# EAGLE design untitled2 (EAGLE 9.6.2)
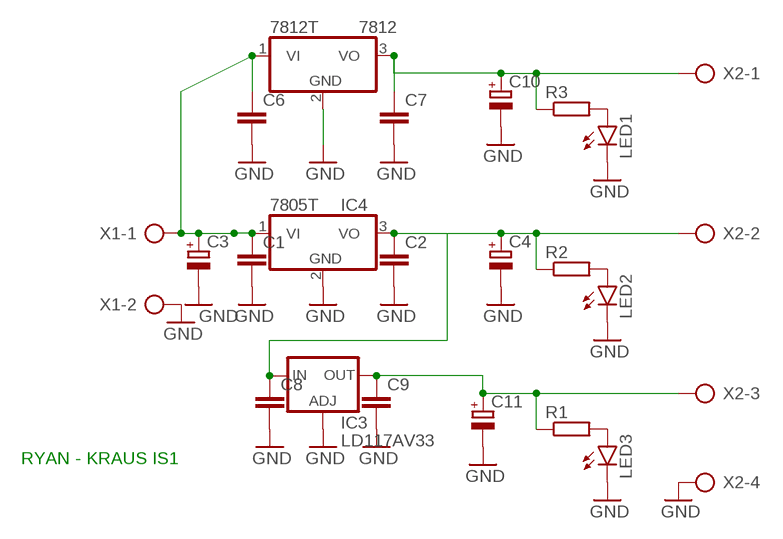
[diagram p0: schematic, sheet 1]

## Parts
7812  7812T  [TO220H]
C1  C-EU050-025X075  [C050-025X075]
C2  C-EU050-025X075  [C050-025X075]
C3  CPOL-EUE5-13  [E5-13]
C4  CPOL-EUE5-6  [E5-6]
C6  C-EU050-025X075  [C050-025X075]
C7  C-EU050-025X075  [C050-025X075]
C8  C-EU050-025X075  [C050-025X075]
C9  C-EU050-025X075  [C050-025X075]
C10  CPOL-EUE5-6  [E5-6]
C11  CPOL-EUE5-6  [E5-6]
IC3  LD117AV33  [TO220L1]
IC4  7805T  [TO220H]
LED1  LED5MM  [LED5MM]
LED2  LED5MM  [LED5MM]
LED3  LED5MM  [LED5MM]
R1  R-EU_0204/7  [0204/7]
R2  R-EU_0204/7  [0204/7]
R3  R-EU_0204/7  [0204/7]
X1  AK300/2  [AK300/2]
X2  AK300/4  [AK300/4]

## Nets
GND: 7812.2(GND) C1.2 C2.2 C3.- C4.- C6.2 C7.2 C8.2 C9.2 C10.- C11.- IC3.1(ADJ) IC4.2(GND) LED1.K(C) LED2.K(C) LED3.K(C) X1.2 X2.4
N$1: 7812.1(VI) C1.1 C3.+ C6.1 IC4.1(VI) X1.1
N$5: C2.1 C4.+ C8.1 IC3.3(IN) IC4.3(VO) R2.1 X2.2
N$7: C9.1 C11.+ IC3.2(OUT) R1.1 X2.3
N$8: 7812.3(VO) C7.1 C10.+ R3.1 X2.1
N$9: LED3.A R1.2
N$10: LED2.A R2.2
N$11: LED1.A R3.2

## Notes on the sheet
- RYAN - KRAUS IS1

## Library data of the parts
7812 IC4 = linear:78*: Positive VOLTAGE REGULATOR Source: http://cache.national.com/ds/LM/LM78L05.pdf http://www.fairchildsemi.com/ds/LM/LM7805.pdf
C1 C2 C6-C9 = rcl:C-EU: CAPACITOR, European symbol; SPICEPREFIX: C
C3 C4 C10 C11 = rcl:CPOL-EU: POLARIZED CAPACITOR, European symbol; SPICEPREFIX: C
IC3 = v-reg:LD117A?*: Low drop fixed and adjustable positive voltage regulators 1 A Source: http://www.st.com/stonline/products/literature/ds/7194/ld1117axx.pdf
LED1-LED3 = led:LED: LED OSRAM: - CHIPLED LG R971, LG N971, LY N971, LG Q971, LY Q971, LO R971, LY R971 LH N974, LH R974 LS Q976, LO Q976, LY Q976 LO Q996 - Hyper CHIPLED LW Q18S LB Q993, LB Q99A, LB R99A - SideLED LS A670, LO A670, LY A670, LG A670, LP A670 LB A673, LV A673, LT A673, LW A673 LH A674 LY A675 LS A676, LA A676, LO A676, LY A676, LW A676 LS A679, LY A679, LG A679 - Hyper Micro SIDELED® LS Y876, LA Y876, LO Y876, LY Y876 LT Y87S - SmartLED LW L88C, LW L88S LB L89C, LB L89S, LG L890 LS L89K, LO L89K, LY L89K LS L896, LA L896, LO L896, LY L896 - TOPLED LS T670, LO T670, LY T670, LG T670, LP T670 LSG T670, LSP T670, LSY T670, LOP T670, LYG T670 LG T671, LOG T671, LSG T671 LB T673, LV T673, LT T673, LW T673 LH T674 LS T676, LA T676, LO T676, LY T676, LB T676, LH T676, LSB T676, LW T676 LB T67C, LV T67C, LT T67C, LS T67K, LO T67K, LY T67K, LW E67C LS E67B, LA E67B, LO E67B, LY E67B, LB E67C, LV E67C, LT E67C LW T67C LS T679, LY T679, LG T679 LS T770, LO T770, LY T770, LG T770, LP T770 LB T773, LV T773, LT T773, LW T773 LH T774 LS E675, LA E675, LY E675, LS T675 LS T776, LA T776, LO T776, LY T776, LB T776 LHGB T686 LT T68C, LB T68C - Hyper Mini TOPLED® LB M676 - Mini TOPLED Santana® LG M470 LS M47K, LO M47K, LY M47K Source: http://www.osram.convergy.de LUXEON: - LUMILED® LXK2-PW12-R00, LXK2-PW12-S00, LXK2-PW14-U00, LXK2-PW14-V00 LXK2-PM12-R00, LXK2-PM12-S00, LXK2-PM14-U00 LXK2-PE12-Q00, LXK2-PE12-R00, LXK2-PE12-S00, LXK2-PE14-T00, LXK2-PE14-U00 LXK2-PB12-K00, LXK2-PB12-L00, LXK2-PB12-M00, LXK2-PB14-N00, LXK2-PB14-P00, LXK2-PB14-Q00 LXK2-PR12-L00, LXK2-PR12-M00, LXK2-PR14-Q00, LXK2-PR14-R00 LXK2-PD12-Q00, LXK2-PD12-R00, LXK2-PD12-S00 LXK2-PH12-R00, LXK2-PH12-S00 LXK2-PL12-P00, LXK2-PL12-Q00, LXK2-PL12-R00 Source: www.luxeon.com KINGBRIGHT: KA-3528ASYC Source: www.kingbright.com
R1-R3 = rcl:R-EU_: RESISTOR, European symbol; SPICEPREFIX: R
X1 = con-ptr500:AK300/2: CONNECTOR; OC_FARNELL: unknown; OC_NEWARK: unknown
X2 = con-ptr500:AK300/4: CONNECTOR; OC_FARNELL: unknown; OC_NEWARK: unknown

## Board
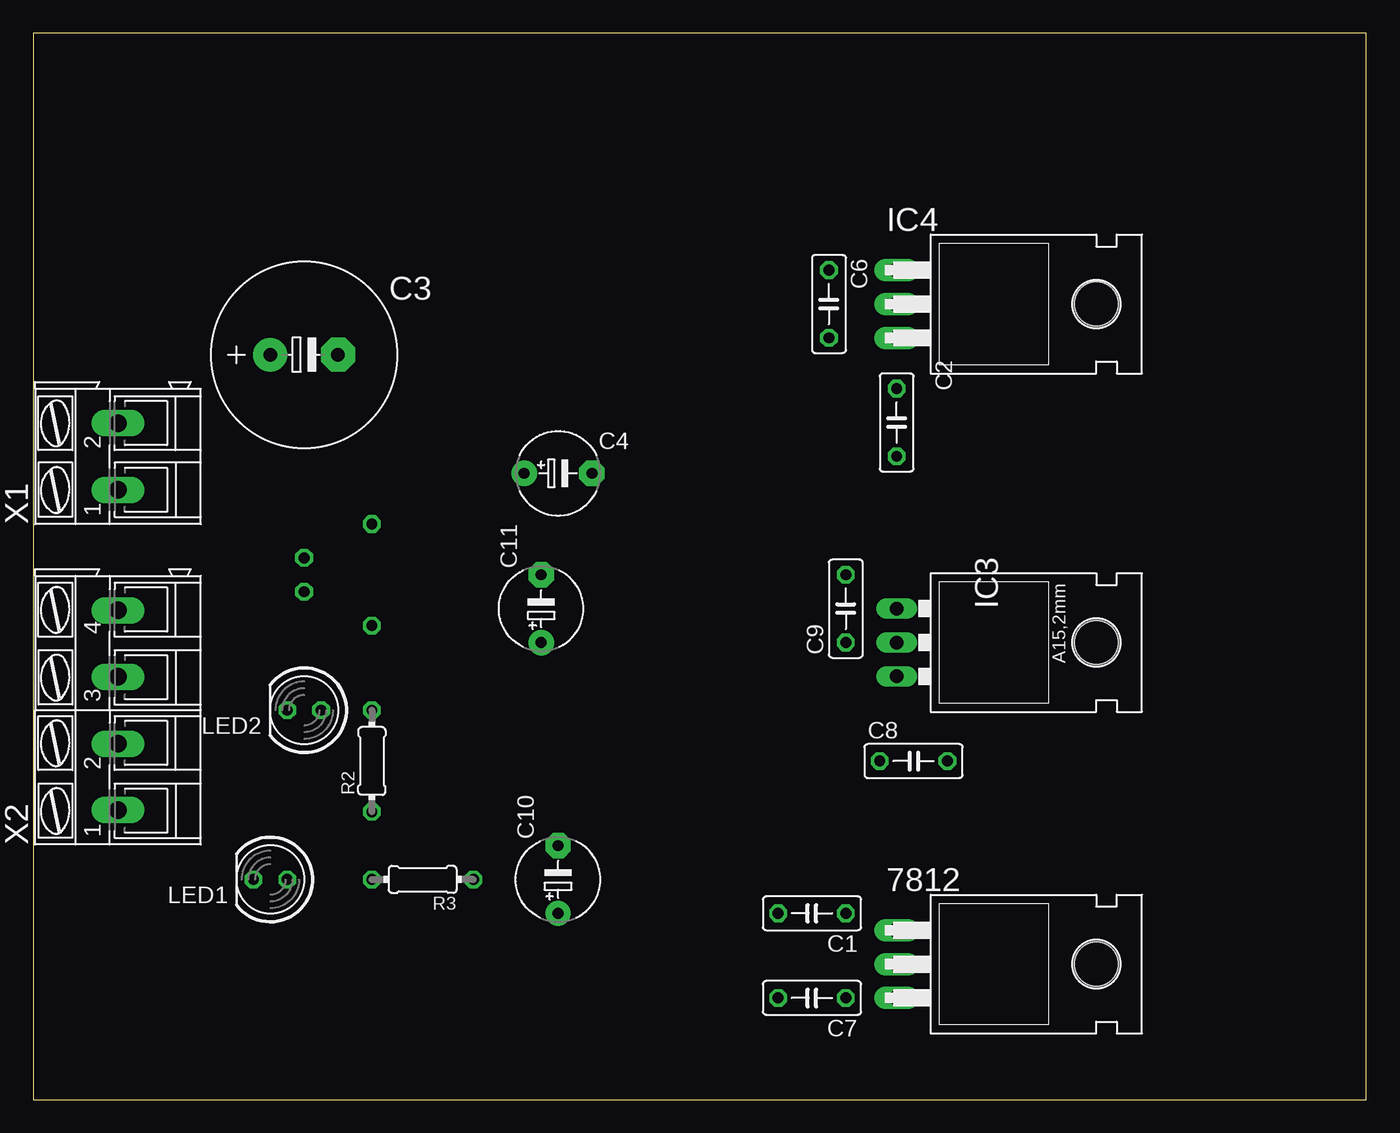
[diagram p1: board, top side]
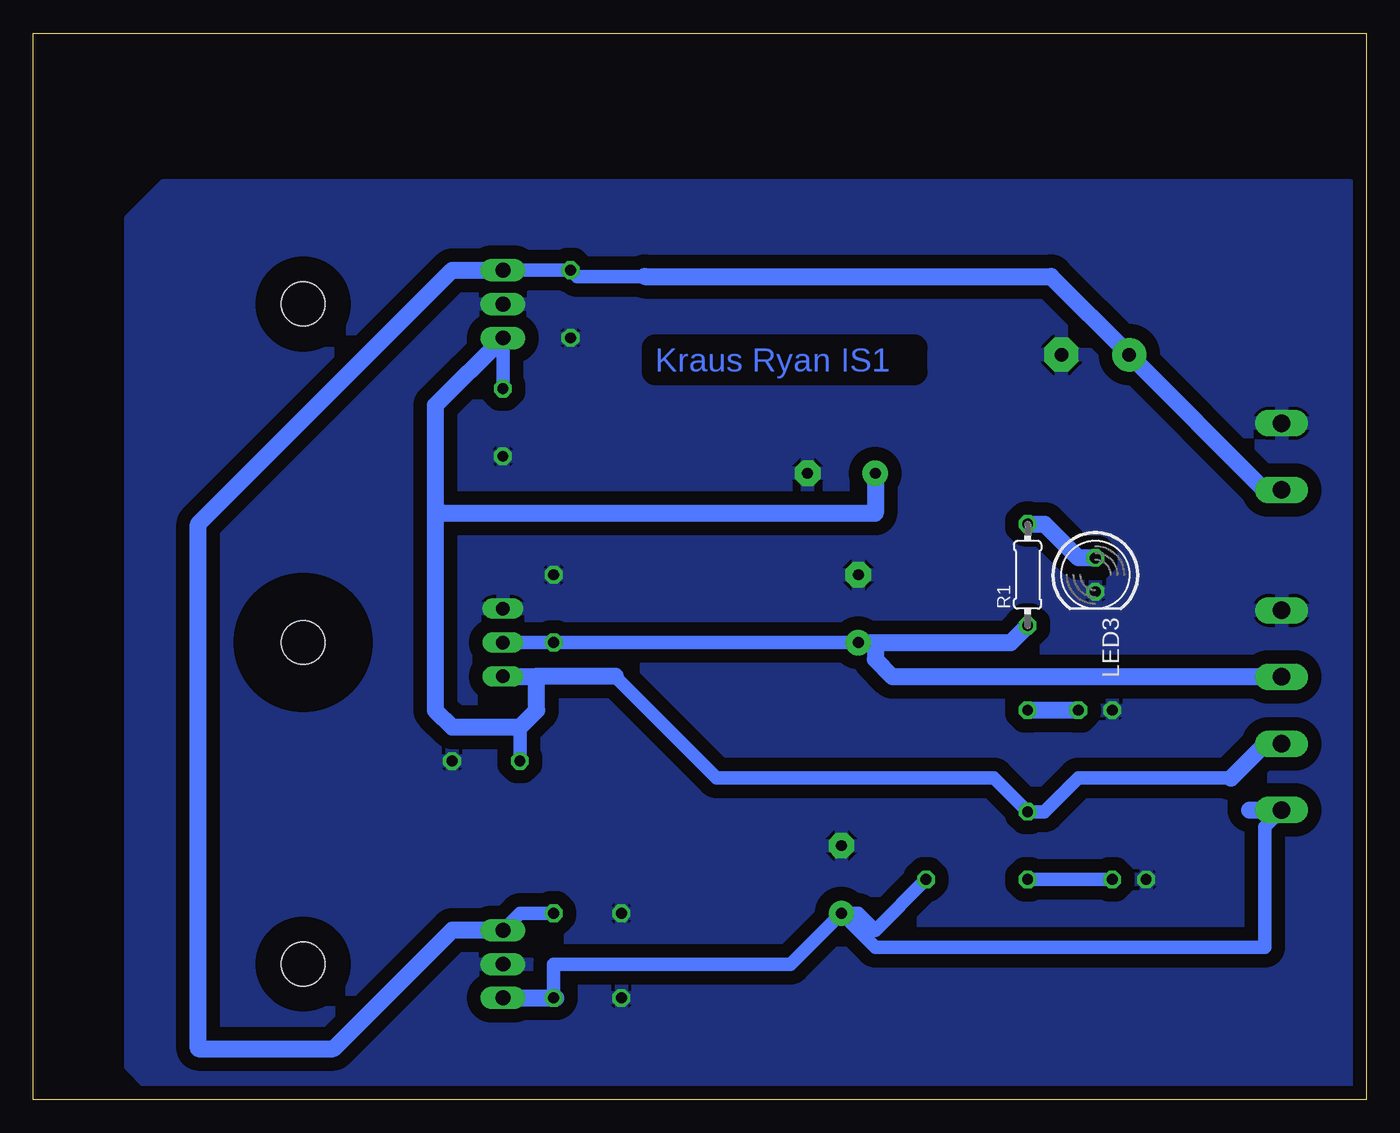
[diagram p2: board, bottom side, seen from below]

Size 100 x 80 mm. Coordinates in mm from the lower left corner, seen from the top.
Outline: 0,0 100,0 100,80 0,80 0,0
Copper layers (1*16): Top 0.035mm / dielectric 1.5mm / Bottom 0.035mm
Design rules "default": minimum track width 6mil, minimum drill 0.35mm, track to track 6mil, track to pad 6mil, pad to pad 6mil, via to via 6mil, smd to smd 6mil, copper to edge 40mil, drill to drill 6mil, minimum pad ring 10mil, minimum via ring 8mil, stop-mask expansion 4mil, vias tented up to drill 0mil, thermal gap 10mil

### Footprints (pad centres in the part's own frame; a part is rotated, then mirrored left to right if it is on the bottom)
TO220H = drill 1.118 long: 1 -2.54,-10.16; 2 0,-10.16; 3 2.54,-10.16 | hole 3.302: 0,4.826
C050-025X075 = drill 0.813 octagon: 1 -2.54,0; 2 2.54,0
E5-13 = drill 1.016 pad 2.54: + -2.54,0 | drill 1.016 pad 2.54 octagon: - 2.54,0
E5-6 = drill 0.813 pad 1.905: + -2.54,0 | drill 0.813 pad 1.905 octagon: - 2.54,0
TO220L1 = drill 1.016 long: 1 -2.54,-3.81; 2 0,-3.81; 3 2.54,-3.81 | hole 3.302: 0,11.176
LED5MM = drill 0.813 octagon: A -1.27,0; K 1.27,0
0204/7 = drill 0.813 octagon: 1 -3.81,0; 2 3.81,0
AK300/2 = drill 1.321 long: 1 -2.515,0; 2 2.489,0
AK300/4 = drill 1.321 long: 1 -7.493,0; 2 -2.515,0; 3 2.515,0; 4 7.493,0

### Placement (x,y rotation side)
7812  74.93,10.16 270 top
C1  58.42,13.97 180 top
C2  64.77,50.8 270 top
C3  20.32,55.88 0 top
C4  39.37,46.99 0 top
C6  59.69,59.69 270 top
C7  58.42,7.62 180 top
C8  66.04,25.4 0 top
C9  60.96,36.83 90 top
C10  39.37,16.51 90 top
C11  38.1,36.83 90 top
IC3  68.58,34.29 270 top
IC4  74.93,59.69 270 top
LED1  17.78,16.51 180 top
LED2  20.32,29.21 180 top
LED3  20.32,39.37 270 bottom
R1  25.4,39.37 90 bottom
R2  25.4,25.4 90 top
R3  29.21,16.51 180 top
X1  6.35,48.26 90 top
X2  6.35,29.21 90 top

### Tracks (layer width: path | path; a pad name or v marks a point on that pad's centre or on a via)
GND
  pour Bottom (isolate 1.016): 83.82,0 86.36,2.54 86.36,66.04 85.09,67.31 83.82,68.58 1.27,68.58 0,67.31 0,66.04 0,5.08 0,2.54 2.54,0
  pour Bottom (isolate 1.016): 1.27,68.58 90.17,68.58 92.71,66.04 92.71,2.54 91.44,1.27 77.47,1.27 1.27,1.27
N$1
  Bottom 0.61: 6.38,45.72 X1.1
  Bottom 1.016: 54.13,61.75 59.21,61.75 C6.1 IC4.1 | C1.1 63.5,13.97 7812.1
  Bottom 1.27: X1.1 7.64,45.74 C3.+ 23.65,61.75 54.13,61.75 | 7812.1 68.58,12.7 77.47,3.81 87.63,3.81 87.63,43.18 68.58,62.23 IC4.1
N$5
  Bottom 1.016: C2.1 IC4.3 | C8.1 63.5,27.94 | 10.13,24.13 21.59,24.13 24.13,21.59 R2.1 27.94,24.13 48.73,24.13 56.35,31.75
  Bottom 1.27: C4.+ 36.83,43.98 69.38,43.98 69.85,44.45 | IC3.3 62.23,31.75 | 56.35,31.75 62.23,31.75 | 10.13,24.13 7.57,26.7 X2.2 | IC4.3 69.85,52.07 69.85,44.45 | 62.23,31.75 62.23,29.21 63.5,27.94 68.58,27.94 69.85,29.21 69.85,44.45
N$7
  Bottom 1.016: IC3.2 C9.1 C11.+
  Bottom 1.27: C11.+ 30.4,34.29 | C11.+ 36.83,34.29 36.83,33.02 35.53,31.73 X2.3 | C11.+ 26.67,34.29 R1.1
N$8
  Bottom 1.016: C10.+ 43.18,10.16 60.96,10.16 C7.1 | R3.1 36.83,12.7 38.1,13.97 C10.+ | X2.1 7.62,20.45 7.62,11.43 36.83,11.43 C10.+
  Bottom 1.27: 60.78,7.62 C7.1 7812.3 | 8.76,21.72 X2.1
N$9
  Bottom 1.27: LED3.A 21.59,40.64 24.13,43.18 R1.2
N$10
  Bottom 1.27: LED2.A R2.2
N$11
  Bottom 1.016: R3.2 LED1.A

### Text on the board
Bottom: Kraus Ryan IS1